# Altium schematic sheet Dionysus_SDRAM (Dave McCoy's conflicted copy 2013-03-24).SchDoc: SDRAM
size B; CompanyName: Cospan Design; DrawnBy: David McCoy; Engineer: David McCoy; DocumentNumber: 5; SheetNumber: 5; SheetTotal: 8
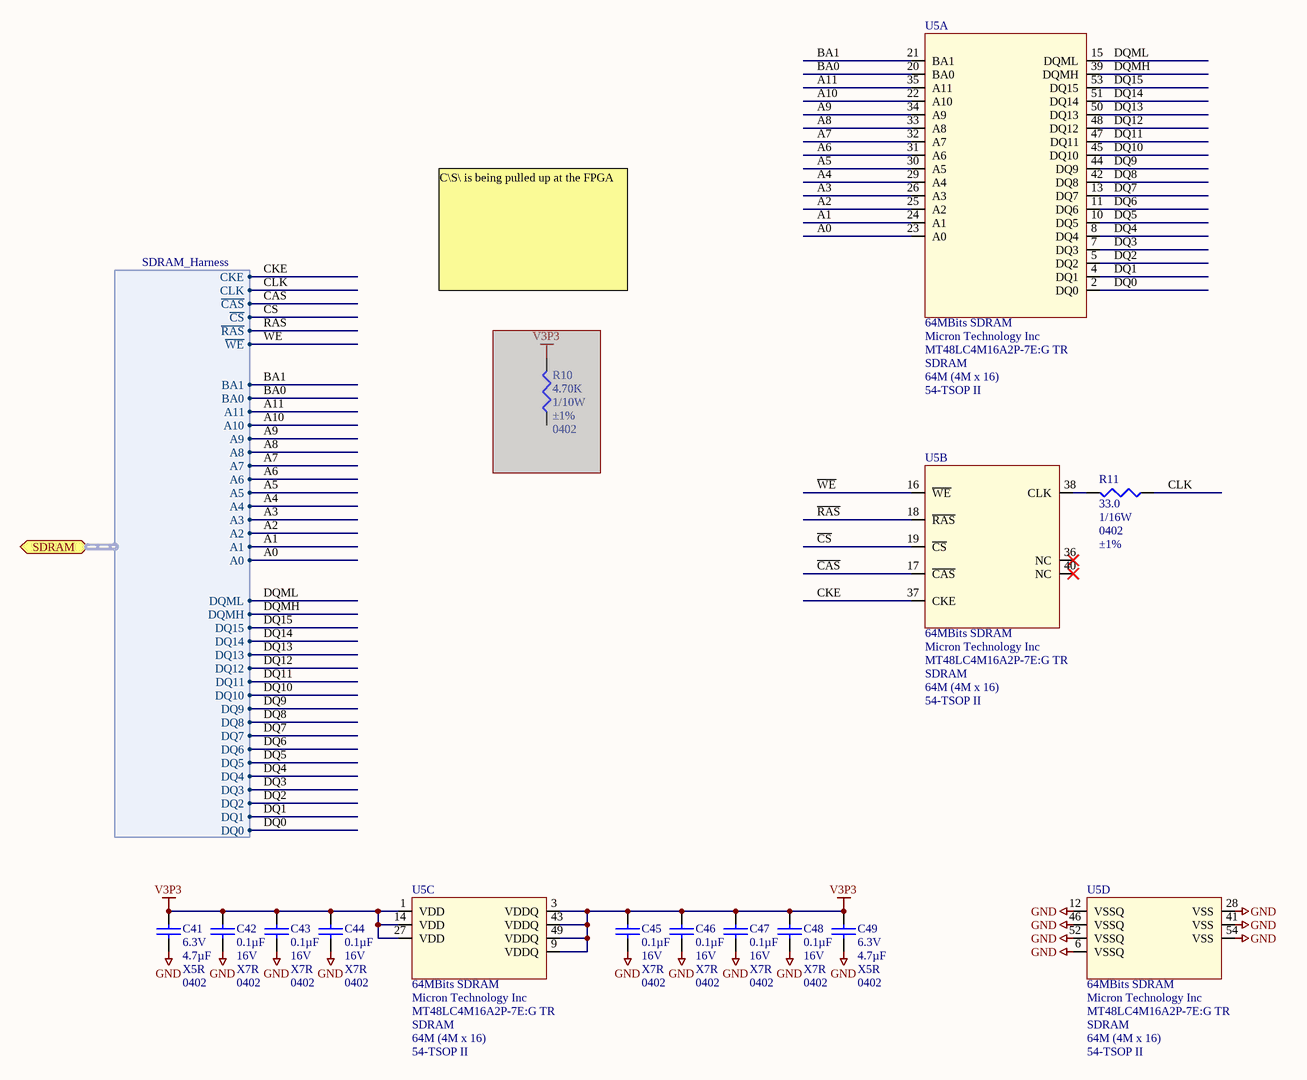
[diagram p0: Dionysus_SDRAM (Dave McCoy's conflicted copy 2013-03-24).SchDoc]

## Parts
C41  Voltage - Rated: 6.3V  Capacitance: 4.7µF  Temperature Coefficient: X5R  Package / Case: 0402  [C_ERA-0402]  (hidden comment: 4.7uF)
C42  Capacitance: 0.1µF  Voltage - Rated: 16V  Temperature Coefficient: X7R  Package / Case: 0402  [C_ERA-0402]  (hidden comment: 0.1uF)
C43  Capacitance: 0.1µF  Voltage - Rated: 16V  Temperature Coefficient: X7R  Package / Case: 0402  [C_ERA-0402]  (hidden comment: 0.1uF)
C44  Capacitance: 0.1µF  Voltage - Rated: 16V  Temperature Coefficient: X7R  Package / Case: 0402  [C_ERA-0402]  (hidden comment: 0.1uF)
C45  Capacitance: 0.1µF  Voltage - Rated: 16V  Temperature Coefficient: X7R  Package / Case: 0402  [C_ERA-0402]  (hidden comment: 0.1uF)
C46  Capacitance: 0.1µF  Voltage - Rated: 16V  Temperature Coefficient: X7R  Package / Case: 0402  [C_ERA-0402]  (hidden comment: 0.1uF)
C47  Capacitance: 0.1µF  Voltage - Rated: 16V  Temperature Coefficient: X7R  Package / Case: 0402  [C_ERA-0402]  (hidden comment: 0.1uF)
C48  Capacitance: 0.1µF  Voltage - Rated: 16V  Temperature Coefficient: X7R  Package / Case: 0402  [C_ERA-0402]  (hidden comment: 0.1uF)
C49  Voltage - Rated: 6.3V  Capacitance: 4.7µF  Temperature Coefficient: X5R  Package / Case: 0402  [C_ERA-0402]  (hidden comment: 4.7uF)
R10  Resistance In Ohms: 4.70K  Power (Watts): 1/10W  Tolerance: ±1%  Case: 0402  [ERA-0402]  (hidden comment: 4.7k Ohms)  (masked out: inside a compile mask, not in the netlist)
R11  Resistance In Ohms: 33.0  Power (Watts): 1/16W  Case: 0402  Tolerance: ±1%  [ERA-0402]  (hidden comment: R_0402_33)
U5  64MBits SDRAM  Manufacturer: Micron Technology Inc  Manufacturer Part Number: MT48LC4M16A2P-7E:G TR  Memory Type: SDRAM  Memory Size: 64M (4M x 16)  Supplier Device Package: 54-TSOP II  [TSOP80P1180X120-54N]  (parts A,B,C,D of 4)

## Ports
SDRAM (harness SDRAM_Harness)

## Harnesses
SDRAM_Harness: CKE, CLK, ~{CAS}, ~{CS}, ~{RAS}, ~{WE}, BA1, BA0, A11, A10, A9, A8, A7, A6, A5, A4, A3, A2, A1, A0, DQML, DQMH, DQ15, DQ14, DQ13, DQ12, DQ11, DQ10, DQ9, DQ8, DQ7, DQ6, DQ5, DQ4, DQ3, DQ2, DQ1, DQ0

## Nets
GND: C41.1 C42.1 C43.1 C44.1 C45.1 C46.1 C47.1 C48.1 C49.1 U5.6(VSSQ) U5.12(VSSQ) U5.28(VSS) U5.41(VSS) U5.46(VSSQ) U5.52(VSSQ) U5.54(VSS)
V3P3: C41.2 C42.2 C43.2 C44.2 C45.2 C46.2 C47.2 C48.2 C49.2 U5.1(VDD) U5.3(VDDQ) U5.9(VDDQ) U5.14(VDD) U5.27(VDD) U5.43(VDDQ) U5.49(VDDQ)
A0: U5.23(A0) ; port SDRAM.A0
A1: U5.24(A1) ; port SDRAM.A1
A2: U5.25(A2) ; port SDRAM.A2
A3: U5.26(A3) ; port SDRAM.A3
A4: U5.29(A4) ; port SDRAM.A4
A5: U5.30(A5) ; port SDRAM.A5
A6: U5.31(A6) ; port SDRAM.A6
A7: U5.32(A7) ; port SDRAM.A7
A8: U5.33(A8) ; port SDRAM.A8
A9: U5.34(A9) ; port SDRAM.A9
A10: U5.22(A10) ; port SDRAM.A10
A11: U5.35(A11) ; port SDRAM.A11
BA0: U5.20(BA0) ; port SDRAM.BA0
BA1: U5.21(BA1) ; port SDRAM.BA1
~{CAS}: U5.17(~{CAS}) ; port SDRAM.~{CAS}
~{CS}: U5.19(~{CS}) ; port SDRAM.~{CS}
CKE: U5.37(CKE) ; port SDRAM.CKE
CLK: R11.2 ; port SDRAM.CLK
DQ0: U5.2(DQ0) ; port SDRAM.DQ0
DQ1: U5.4(DQ1) ; port SDRAM.DQ1
DQ2: U5.5(DQ2) ; port SDRAM.DQ2
DQ3: U5.7(DQ3) ; port SDRAM.DQ3
DQ4: U5.8(DQ4) ; port SDRAM.DQ4
DQ5: U5.10(DQ5) ; port SDRAM.DQ5
DQ6: U5.11(DQ6) ; port SDRAM.DQ6
DQ7: U5.13(DQ7) ; port SDRAM.DQ7
DQ8: U5.42(DQ8) ; port SDRAM.DQ8
DQ9: U5.44(DQ9) ; port SDRAM.DQ9
DQ10: U5.45(DQ10) ; port SDRAM.DQ10
DQ11: U5.47(DQ11) ; port SDRAM.DQ11
DQ12: U5.48(DQ12) ; port SDRAM.DQ12
DQ13: U5.50(DQ13) ; port SDRAM.DQ13
DQ14: U5.51(DQ14) ; port SDRAM.DQ14
DQ15: U5.53(DQ15) ; port SDRAM.DQ15
DQMH: U5.39(DQMH) ; port SDRAM.DQMH
DQML: U5.15(DQML) ; port SDRAM.DQML
~{RAS}: U5.18(~{RAS}) ; port SDRAM.~{RAS}
~{WE}: U5.16(~{WE}) ; port SDRAM.~{WE}
NetR11_1: R11.1 U5.38(CLK)

Not connected (* = marked no-connect by the designer): U5 36(NC)* 40(NC)*

## Notes on the sheet
- C\S\ is being pulled up at the FPGA
- Title:
- http://www.cospandesign.com
- Cospan Design
- Project:
- Document:
- Engineer:
- Drawn By:
- Approved By:
- Revision:
- Date:
- Number:
- of

## Library data of the parts
C41 C49 = C_0402_4.7UF: CAP CER 4.7UF 6.3V X5R 0402; Manufacturer: Murata Electronics North America; Manufacturer Part Number: GRM155R60J475ME87D; Tolerance: ±20%; Supplier 1: Digi-Key; Supplier Part Number 1: 490-5408-1-ND; RoHS: RoHS Compliant; Category: Capacitors; Stock 1: 1176918; Pricing: 1=0.46, 10=0.365, 50=0.264, 100=0.22, 250=0.165, 500=0.1408, 1000=0.11, 5000=0.0836 (USD); Mounting Type: Surface Mount, MLCC; Operating Temperature: -55°C ~ 85°C; Applications: General Purpose; Ratings: -; Size / Dimension: 0.039" L x 0.020" W (1.00mm x 0.50mm); Height: -; Thickness: 0.022" (0.55mm); Lead Spacing: -; Features: -; Packaging: Cut Tape (CT); Lead Style: -; ComponentLink1URL: http://www.murata.com/products/catalog/pdf/c02e.pdf; ComponentLink1Description: http://www.murata.com/products/catalog/pdf/c02e.pdf; Supplier 2: Digi-Key; Stock 2: 8098; Pricing 2: 1=0.32, 10=0.28, 100=0.14, 250=0.112, 500=0.102, 1000=0.092, 5000=0.076 (USD); Height - Seated (Max): -; Thickness (Max): 0.026" (0.65mm); ComponentLink2URL: http://www.tdk.com/pdf/general_B11.pdf; ComponentLink2Description: http://www.tdk.com/pdf/general_B11.pdf; Supplier Part Number 2: 445-7395-1-ND
C42-C48 = C_0402_0.1UF_16V: CAP CER .10UF 16V X7R 0402; Manufacturer: TDK Corporation; Manufacturer Part Number: C1005X7R1C104K; Tolerance: ±10%; Supplier 1: Digi-Key; Supplier Part Number 1: 445-4952-1-ND; RoHS: RoHS Compliant; Category: Capacitors; Stock 1: 230800; Pricing: 10=0.024, 100=0.0143, 500=0.00826, 1000=0.00572 (USD); Mounting Type: Surface Mount, MLCC; Features: General Purpose; Lead Spacing: -; Thickness: 0.50mm; Packaging: Cut Tape (CT); ComponentLink1URL: http://www.tdk.co.jp/tefe02/e412_c.pdf; ComponentLink1Description: http://www.tdk.co.jp/tefe02/e412_c.pdf; Operating Temperature: -55°C ~ 125°C
R10 = R_0402_4.70K: RES 4.70K OHM 1/10W 1% 0402 SMD; Manufacturer: Yageo; Manufacturer Part Number: RC0402FR-074K7L; Description: RES 4.7K OHM 1/16W 1% 0402 SMD; Temperature Coefficient: ±100ppm/°C; Supplier 1: Digi-Key; Supplier Part Number 1: 311-4.7KLRCT-ND; RoHS: RoHS Compliant; Category: Resistors; Stock 1: 3610; Pricing: 10=0.014, 100=0.0063, 500=0.00382, 1000=0.0027, 5000=0.00203 (USD); Composition: Thick Film; Features: -; Size / Dimension: 0.039" L x 0.020" W (1.00mm x 0.50mm); Height: 0.016" (0.40mm); Packaging: Cut Tape (CT); ComponentLink1URL: http://www.yageo.com/documents/recent/PYu-RC0402_51_RoHS_L_6.pdf; ComponentLink1Description: http://www.yageo.com/documents/recent/PYu-RC0402_51_RoHS_L_6.pdf; Resistance (Ohms): 4.7K; Package / Case: 0402 (1005 Metric); Number of Terminations: 2
R11 = R_0402_33: RES 33.0 OHM 1/16W 1% 0402 SMD; Manufacturer: Yageo; Manufacturer Part Number: RC0402FR-0733RL; Resistance (Ohms): 33; Temperature Coefficient: ±100ppm/°C; Supplier 1: Digi-Key; Supplier Part Number 1: 311-33.0LRCT-ND; RoHS: RoHS Compliant; Category: Resistors; Stock 1: 733920; Pricing: 10=0.014, 50=0.0104, 100=0.0079, 250=0.00584, 500=0.00432, 1000=0.00288 (USD); Composition: Thick Film; Features: -; Size / Dimension: 0.039" L x 0.020" W (1.00mm x 0.50mm); Height: 0.014" (0.35mm); Number of Terminations: 2; Packaging: Cut Tape (CT); Package / Case: 0402 (1005 Metric); ComponentLink1URL: http://www.yageo.com/documents/recent/PYu-RC0402_51_RoHS_L_6.pdf; ComponentLink1Description: http://www.yageo.com/documents/recent/PYu-RC0402_51_RoHS_L_6.pdf
U5 = U_MT48LC4M16A2P: IC SDRAM 64MBIT 133MHZ 54TSOP; Format - Memory: RAM; Interface: Parallel; Voltage - Supply: 3 V ~ 3.6 V; Supplier 1: Digi-Key; RoHS: RoHS Compliant; Category: Integrated Circuits (ICs); Stock 1: 16881; Pricing 1: 1=5.46, 10=4.914, 25=4.4592, 100=4.004, 250=3.64, 500=3.185 (USD); Speed: 133MHz; Operating Temperature: 0°C ~ 70°C; Package / Case: 54-TSOP (0.400", 10.16mm Width); Packaging: Cut Tape (CT); ComponentLink1URL: http://download.micron.com/pdf/datasheets/dram/sdram/64MSDRAM.pdf; ComponentLink1Description: http://download.micron.com/pdf/datasheets/dram/sdram/64MSDRAM.pdf; Supplier Part Number 1: 557-1089-1-ND